# EAGLE design Gadget-Box-Photon-modules (EAGLE 6.6.0)

## Sheet 1 of 2
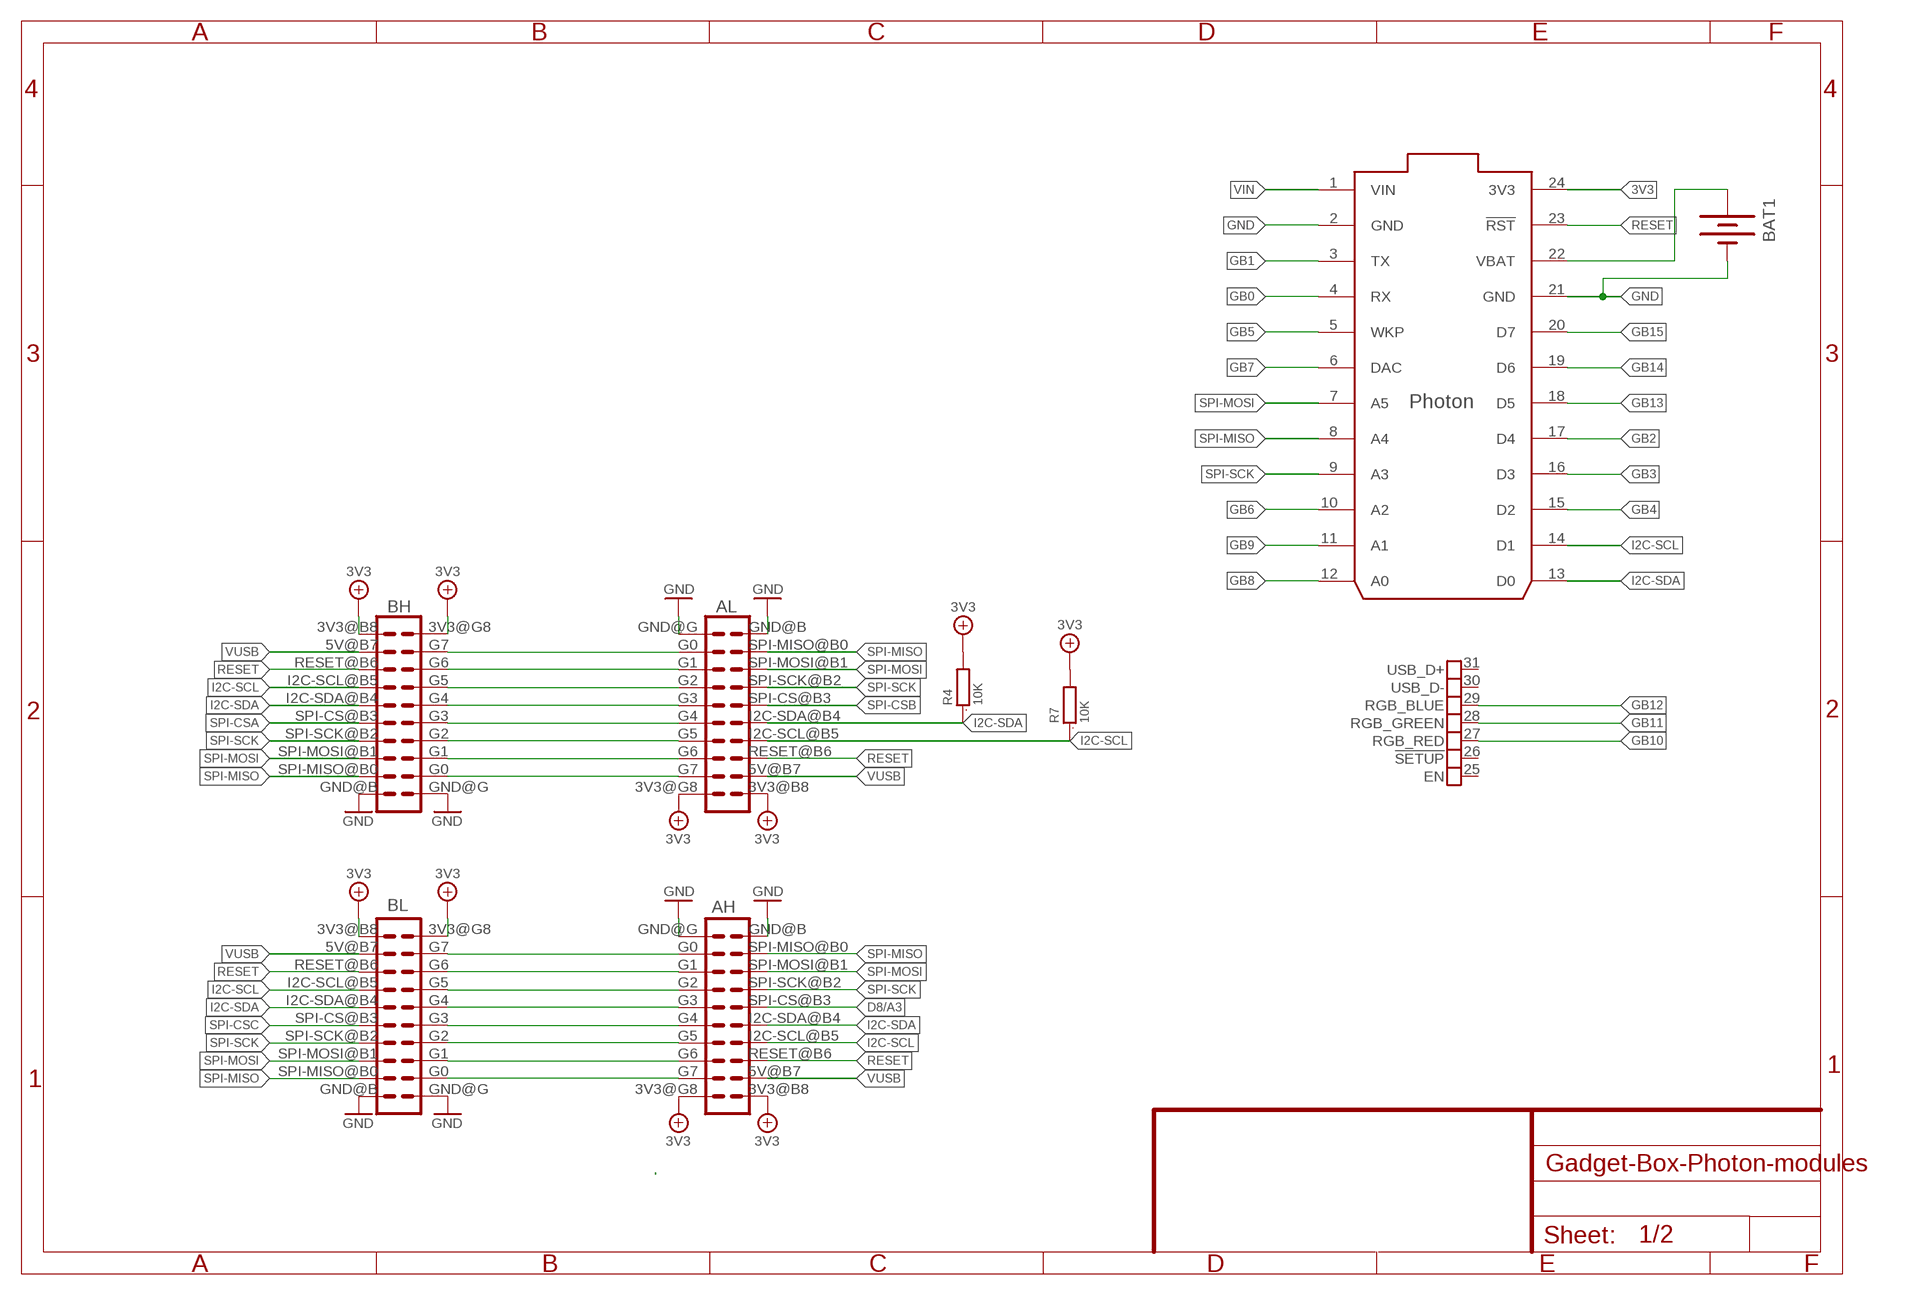
[diagram p0: schematic, sheet 1]

### Parts
AH  ECOGECOG_SLOT_ALT1  [ECOG_ALT1]
AL  ECOGECOG_SLOT_ALT1  [ECOG_ALT1]
BAT1  BATTERY12MM  [BATTCON_12MM]
BH  ECOGECOG_SLOT_ALT1  [ECOG_ALT1]
BL  ECOGECOG_SLOT_ALT1  [ECOG_ALT1]
R4  10K  R0603  [0603]
R7  10K  R0603  [0603]
U$7  PHOTON_SMD  [PHOTON_SMD]

### Nets
3V3: AH.3V3@B8(3V3) AH.3V3@G8(3V3) AL.3V3@B8(3V3) AL.3V3@G8(3V3) BH.3V3@B8(3V3) BH.3V3@G8(3V3) BL.3V3@B8(3V3) BL.3V3@G8(3V3) R4.2 R7.2 U$7.24(3V3)
D8/A3: AH.SPI-CS@B3(SPI-CS)
GB0: AL.G0 BH.G7 U$7.4(RX)
GB1: AL.G1 BH.G6 U$7.3(TX)
GB2: AL.G2 BH.G5 U$7.17(D4)
GB3: AL.G3 BH.G4 U$7.16(D3)
GB4: AL.G4 BH.G3 U$7.15(D2)
GB5: AL.G5 BH.G2 U$7.5(WKP)
GB6: AL.G6 BH.G1 U$7.10(A2)
GB7: AL.G7 BH.G0 U$7.6(DAC)
GB8: AH.G0 BL.G7 U$7.12(A0)
GB9: AH.G1 BL.G6 U$7.11(A1)
GB10: AH.G2 BL.G5 U$7.27(RGB_RED)
GB11: AH.G3 BL.G4 U$7.28(RGB_GREEN)
GB12: AH.G4 BL.G3 U$7.29(RGB_BLUE)
GB13: AH.G5 BL.G2 U$7.18(D5)
GB14: AH.G6 BL.G1 U$7.19(D6)
GB15: AH.G7 BL.G0 U$7.20(D7)
GND [gnd]: AH.GND@B(GND) AH.GND@G(GND) AL.GND@B(GND) AL.GND@G(GND) BAT1.GND(-) BH.GND@B(GND) BH.GND@G(GND) BL.GND@B(GND) BL.GND@G(GND) U$7.2(GND) U$7.21(GND) ; also sheet 2
I2C-SCL: AH.I2C-SCL@B5(I2C-SCL) AL.I2C-SCL@B5(I2C-SCL) BH.I2C-SCL@B5(I2C-SCL) BL.I2C-SCL@B5(I2C-SCL) R7.1 U$7.14(D1)
I2C-SDA: AH.I2C-SDA@B4(I2C-SDA) AL.I2C-SDA@B4(I2C-SDA) BH.I2C-SDA@B4(I2C-SDA) BL.I2C-SDA@B4(I2C-SDA) R4.1 U$7.13(D0)
N$3: BAT1.PWR@1(+) U$7.22(VBAT)
RESET: AH.RESET@B6(RESET) AL.RESET@B6(RESET) BH.RESET@B6(RESET) BL.RESET@B6(RESET) U$7.23(!RST)
SPI-CSA: BH.SPI-CS@B3(SPI-CS)
SPI-CSB: AL.SPI-CS@B3(SPI-CS)
SPI-CSC: BL.SPI-CS@B3(SPI-CS)
SPI-MISO: AH.SPI-MISO@B0(SPI-MISO) AL.SPI-MISO@B0(SPI-MISO) BH.SPI-MISO@B0(SPI-MISO) BL.SPI-MISO@B0(SPI-MISO) U$7.8(A4)
SPI-MOSI: AH.SPI-MOSI@B1(SPI-MOSI) AL.SPI-MOSI@B1(SPI-MOSI) BH.SPI-MOSI@B1(SPI-MOSI) BL.SPI-MOSI@B1(SPI-MOSI) U$7.7(A5)
SPI-SCK: AH.SPI-SCK@B2(SPI-SCK) AL.SPI-SCK@B2(SPI-SCK) BH.SPI-SCK@B2(SPI-SCK) BL.SPI-SCK@B2(SPI-SCK) U$7.9(A3)
VIN: U$7.1(VIN) ; also sheet 2
VUSB: AH.5V@B7(5V) AL.5V@B7(5V) BH.5V@B7(5V) BL.5V@B7(5V) ; also sheet 2
Unconnected: U$7.25(EN) U$7.26(!SETUP) U$7.30(USB_D-) U$7.31(USB_D+)

## Sheet 2 of 2
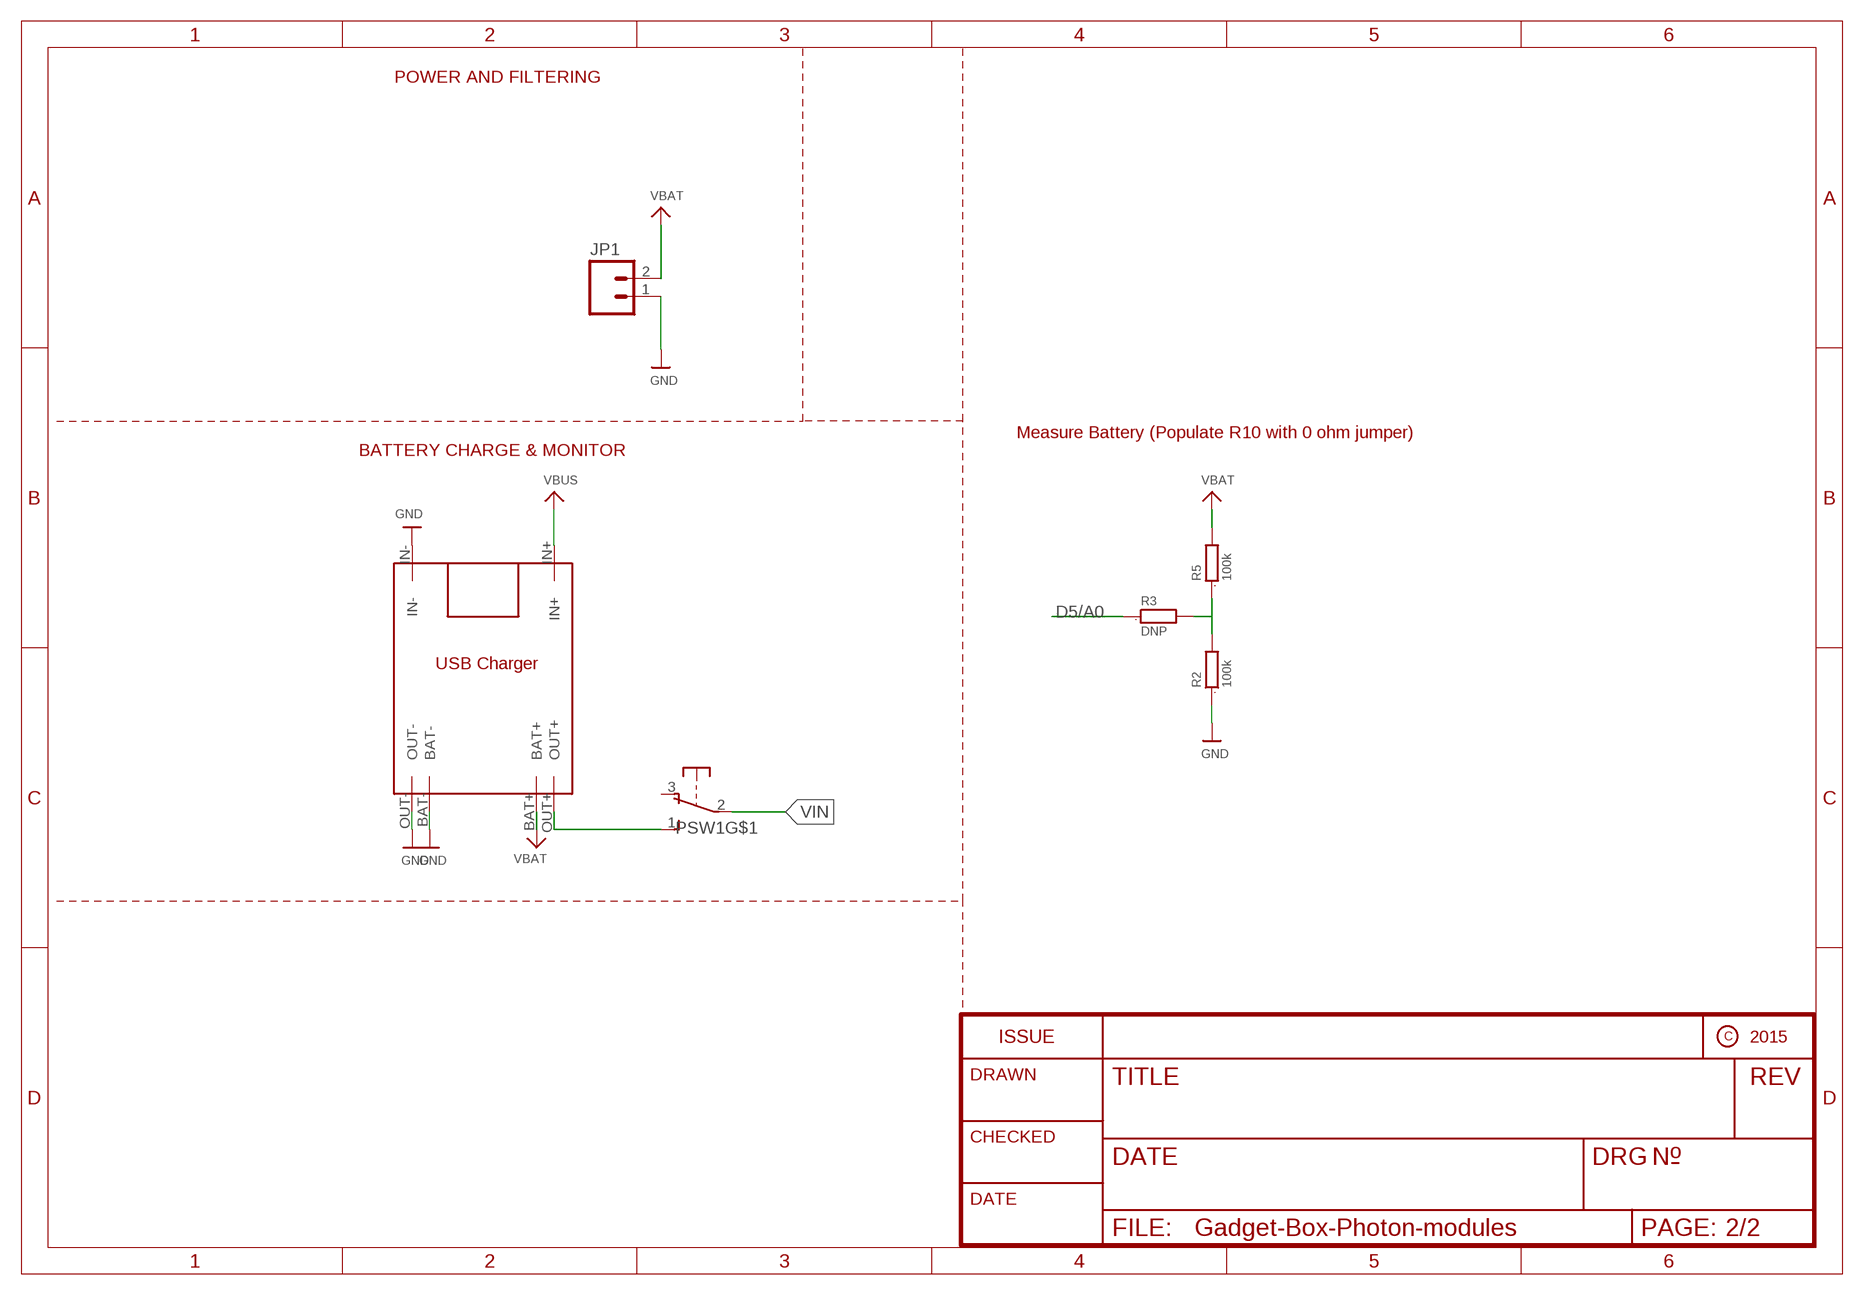
[diagram p1: schematic, sheet 2]

### Parts
JP1  M02-JST-2-PTH-NO_SILK  [JST-2-PTH-NS]
PSW1  OS102011MA1Q  [OS102011MA1Q]
R2  100k  R0603  [0603]
R3  DNP  R0603  [0603]
R5  100k  R0603  [0603]
U$1  TP4056  [TP4056]

### Nets
D5/A0: R3.1
GND [gnd]: JP1.1 R2.1 U$1.BAT- U$1.IN- U$1.OUT- ; also sheet 1
N$2: R2.2 R3.2 R5.1
VBATTTERY: JP1.2 R5.2 U$1.BAT+ ; supply symbol labelled VBAT
VIN: PSW1.2(P) ; also sheet 1
VOUT: PSW1.1(S) U$1.OUT+
VUSB: U$1.IN+ ; supply symbol labelled VBUS ; also sheet 1
Unconnected: PSW1.3(O) PSW1.MT1(MT) PSW1.MT2(MT)

### Notes on the sheet
- POWER AND FILTERING
- Measure Battery (Populate R10 with 0 ohm jumper)
- BATTERY CHARGE & MONITOR

## Library data of the parts
AH AL BH BL = eCogs:ECOG; PARTNO: PPPC102LFBN-RC,SULLINS CONNECTOR SOLUTIONS,dk,S6106-ND,"CONN HEADER FEM 20POS.1"" DL GOLD", REF67
BAT1 = SparkFun-Electromechanical:BATTERY: Battery Holders Various common sizes : AA, AAA, 18650 (PRT-12895), 20mm coin cell and 12mm coin cell. 20MM_4LEGS, BATT-10373; PROD_ID: BATT-08044
JP1 = SparkFun:M02: Header 2 Standard 2-pin 0.1" header. Use with straight break away headers (SKU : PRT-00116), right angle break away headers (PRT-00553), swiss pins (PRT-00743), machine pins (PRT-00117), and female headers (PRT-00115). Molex polarized connector foot print use with SKU : PRT-08233 with associated crimp pins and housings.; PARTNO: B2B-PH-SM4-TB(LF)(SN),JST SALES AMERICA INC (VA),dk,455-1734-1-ND ,"2 Positions Header, Shrouded Connector 0.079 (2.00mm) Through Hole Tin ", REF87
PSW1 = adafruit:OS102011MA1Q: OS10201MA1Q through-hole right angle switch http://www.ladyada.net/library/eagle; PARTNO: OS102011MA1QN1,C&K Components,dk,CKN9559-ND,SWITCH SLIDE SPDT 100MA 12V , REF72
R2 R5 = GadgetFactory:R: RESISTOR, European symbol; PARTNO: RC0603JR-07100KL,YAGEO (VA),dk,311-100KGRCT-ND,RES SMD 100K OHM 5% 1/10W 0603 , REF76
R3 = GadgetFactory:R: RESISTOR, European symbol; BOM: EXCLUDE
R4 R7 = GadgetFactory:R: RESISTOR, European symbol; PARTNO: RC0603JR-0710KL,YAGEO (VA),dk,311-10KGRCT-ND,RES SMD 10K OHM 5% 1/10W 0603 , REF36
U$1 = TP4056 charging module:TP4056
U$7 = Spark:PHOTON_SMD: Photon (without headers) - designed to be surface mounted with 7 extra exposed pads on the bottom of the board which include, 3 RGB LED outputs, /SETUP, EN (3.3V SMPS enable input), USB D+ and USB D-.

## Net classes
2 gnd: width 0.254 mm, drill 0.381 mm, clearance 0.254 mm
3 usbvcc: width 0.254 mm, drill 0.381 mm, clearance 0.254 mm
4 aref: width 0.254 mm, drill 0.381 mm, clearance 0.254 mm

## Board
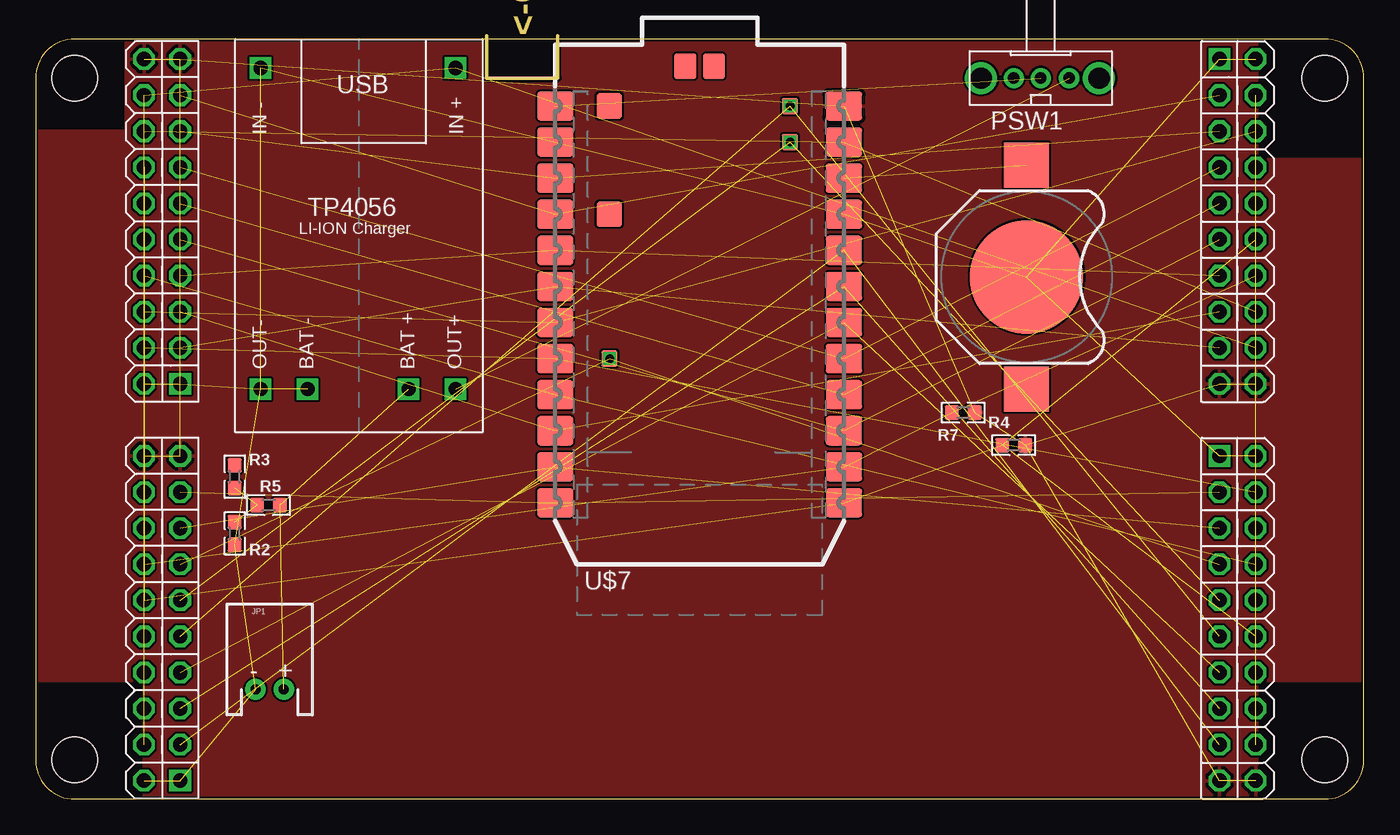
[diagram p2: board, top side]
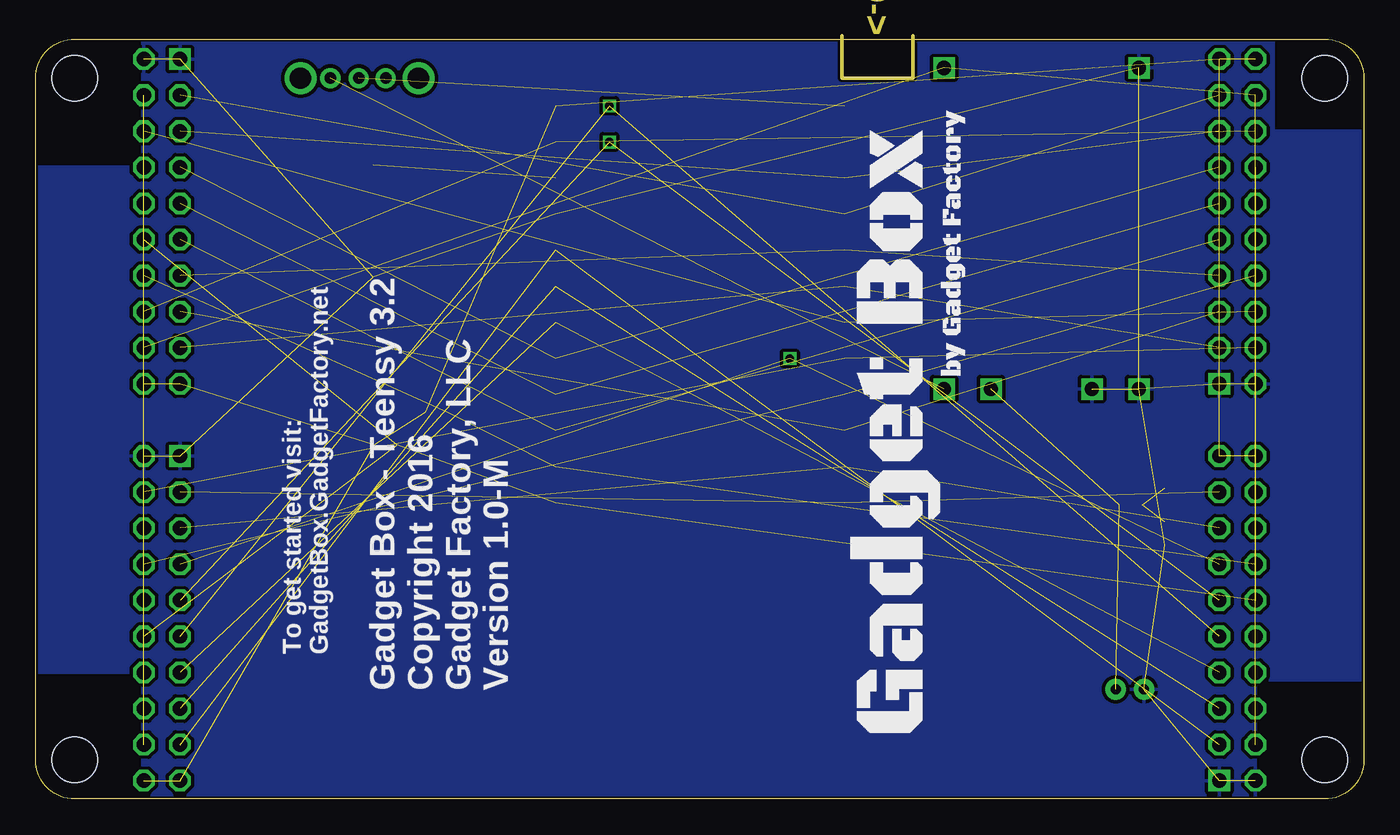
[diagram p3: board, bottom side, seen from below]

Size 93.5 x 53.75 mm. Coordinates in mm from the lower left corner, seen from the top.
Outline: 31.75,53.75 31.75,50.75 36.75,50.75 36.75,53.75
Copper layers (1*16): Top 0.035mm / dielectric 1.5mm / Bottom 0.035mm
Design rules "hackvana *": minimum track width 6mil, minimum drill 0.3mm, track to track 6mil, track to pad 6mil, pad to pad 6mil, via to via 6mil, smd to smd 0mil, copper to edge 6mil, drill to drill 6mil, minimum pad ring 10mil, minimum via ring 6mil, stop-mask expansion 2mil, vias tented up to drill 100mil, thermal gap 10mil

### Footprints (pad centres in the part's own frame; a part is rotated, then mirrored left to right if it is on the bottom)
ECOG93P53P5 = hole 3.2: 4,4; 92,4; 92,52; 4,52
ECOG_ALT1 = drill 1.016 octagon: 3V3@B8 21.59,3.81; 3V3@G8 21.59,1.27; 5V@B7 19.05,3.81; G0 1.27,1.27; G1 3.81,1.27; G2 6.35,1.27; G3 8.89,1.27; G4 11.43,1.27; G5 13.97,1.27; G6 16.51,1.27; G7 19.05,1.27; GND@B -1.27,3.81; I2C-SCL@B5 13.97,3.81; I2C-SDA@B4 11.43,3.81; RESET@B6 16.51,3.81; SPI-CS@B3 8.89,3.81; SPI-MISO@B0 1.27,3.81; SPI-MOSI@B1 3.81,3.81; SPI-SCK@B2 6.35,3.81 | drill 1.016 square: GND@G -1.27,1.27
BATTCON_12MM = smd 8 x 8: GND 0,0 | smd 3.175 x 3.175: PWR@1 -7.874,0; PWR@2 7.874,0
JST-2-PTH-NS = drill 0.7 pad 1.448: 1 -1,0; 2 1,0
OS102011MA1Q = drill 0.8 pad 1.422: 1 -2,0; 2 0,0; 3 1.9,0 | drill 1.5 pad 2.184: MT1 -4.1,0; MT2 4.2,0
0603 = smd 1 x 1: 1 -0.8,0; 2 0.8,0
TP4056 = drill 1 pad 1.422 square: BAT+ 3.505,-8.89; BAT- -3.607,-8.89; IN+ 6.807,13.716; IN- -6.909,13.716; OUT+ 6.807,-8.89; OUT- -6.909,-8.89
PHOTON_SMD = smd 2.54 x 2.032: 1 0,32.258; 2 0,29.718; 3 0,27.178; 4 0,24.638; 5 0,22.098; 6 0,19.558; 7 0,17.018; 8 0,14.478; 9 0,11.938; 10 0,9.398; 11 0,6.858; 12 0,4.318; 13 20.32,4.318; 14 20.32,6.858; 15 20.32,9.398; 16 20.32,11.938; 17 20.32,14.478; 18 20.32,17.018; 19 20.32,19.558; 20 20.32,22.098; 21 20.32,24.638; 22 20.32,27.178; 23 20.32,29.718; 24 20.32,32.258 | smd 1.778 x 1.778: 25 3.81,32.258; 26 3.81,24.638 | smd 1.143 x 1.143: 27 3.81,14.478; 28 16.51,29.718; 29 16.51,32.258 | smd 1.524 x 1.778: 30 11.176,35.052; 31 9.144,35.052

### Placement (x,y rotation side)
$$U$1  [ECOG93P53P5]  -1.25,-1.25 0 top
AH  82.06,22.88 270 top
AL  82.06,50.82 270 top
BAT1  69.75,36.75 270 top
BH  11.45,30.5 90 top
BL  11.45,2.56 90 top
JP1  16.48,7.72 0 top
PSW1  70.75,50.75 180 top
R2  14.02,18.69 90 top
R3  14.02,22.69 270 top
R4  68.85,24.91 0 top
R5  16.4,20.69 0 top
R7  65.3,27.2 0 top
U$1  22.75,37.75 0 top
U$7  36.58,16.53 0 top
U$100  [GADGETBOX_TEXT]  32.79,25.93 90 bottom

### Tracks (layer width: path | path; a pad name or v marks a point on that pad's centre or on a via)
3V3  (10 unrouted)
  pour Top: -1.25,8.37 -1.25,47.03 6.37,47.03 6.37,54.63 85.95,54.63 85.95,45.01 94.92,45.01 94.92,8.37 85.95,8.37 85.95,-1.25 7.64,-1.25 7.64,8.37
GB0  (2 unrouted)
GB1  (2 unrouted)
GB2  (2 unrouted)
GB3  (2 unrouted)
GB4  (2 unrouted)
GB5  (2 unrouted)
GB6  (2 unrouted)
GB7  (2 unrouted)
GB8  (2 unrouted)
GB9  (2 unrouted)
GB10  (2 unrouted)
GB11  (2 unrouted)
GB12  (2 unrouted)
GB13  (2 unrouted)
GB14  (2 unrouted)
GB15  (2 unrouted)
GND  (15 unrouted)
  pour Bottom: -1.25,8.4 -1.25,47.01 6.37,47.01 6.37,55.14 85.95,55.14 85.95,44.47 94.92,44.47 94.92,8.91 85.95,8.91 85.95,-1.76 7.64,-1.76 7.64,8.4
I2C-SCL  (5 unrouted)
I2C-SDA  (5 unrouted)
N$2  (2 unrouted)
N$3  (1 unrouted)
N$4  (via drill 0.6)
  other vias: 40.41,31.01
N$5  (via drill 0.6)
  other vias: 53.11,46.25
N$6  (via drill 0.6)
  other vias: 53.11,48.79
RESET  (4 unrouted)
SPI-MISO  (4 unrouted)
SPI-MOSI  (4 unrouted)
SPI-SCK  (4 unrouted)
VBATTTERY  (2 unrouted)
VIN  (1 unrouted)
VOUT  (1 unrouted)
VUSB  (4 unrouted)

### Text on the board
Dimension: <-Cutout
bPlace: To get started visit: / GadgetBox.GadgetFactory.net | Gadget Box - Teensy 3.2 / Copyright 2016 / Gadget Factory, LLC / Version 1.0-M
Reference: TOP Silkscreen is on layer 200